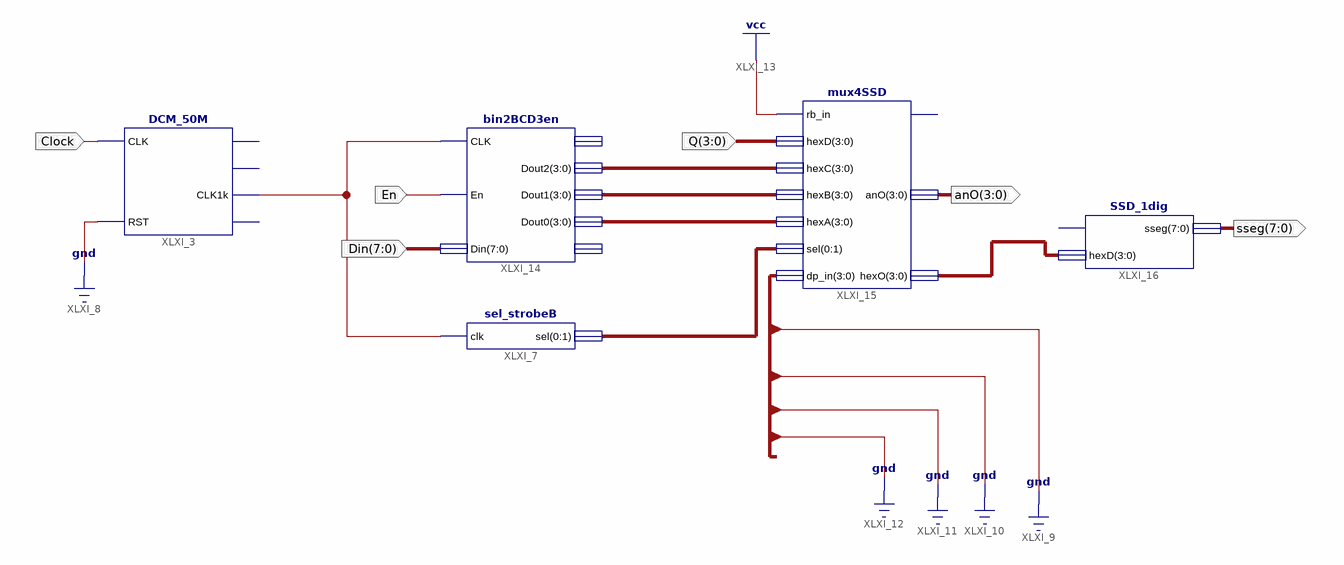
[diagram p0: schematic sheet 1]
// Xilinx ISE schematic lab9_BCDBus.sch (spartan3e) as structural Verilog: 5 symbols, 6 ports
module lab9_BCDBus (
  input  En,
  input  [7:0] Din,
  input  Clock,
  input  [3:0] Q,
  output [7:0] sseg,
  output [3:0] anO
);

  wire XLXN_31;
  wire [1:0] XLXN_15;
  wire [3:0] XLXN_6, XLXN_7, XLXN_8, XLXN_13;

  SSD_1dig XLXI_16 (.hexD(XLXN_13), .sseg(sseg));  // open: dp_in
  DCM_50M XLXI_3 (.CLK(Clock), .RST(1'b0), .CLK1k(XLXN_31));  // open: CLK1M, CLK10k, CLK1
  sel_strobeB XLXI_7 (.clk(XLXN_31), .sel({XLXN_15[0], XLXN_15[1]}));
  bin2BCD3en XLXI_14 (
    .CLK(XLXN_31), .En(En), .Din(Din), .Dout2(XLXN_8), .Dout1(XLXN_7), .Dout0(XLXN_6));  // open: Dout3, RBout
  mux4SSD XLXI_15 (
    .rb_in(1'b1), .hexD(Q), .hexC(XLXN_8), .hexB(XLXN_7), .hexA(XLXN_6), .sel({XLXN_15[0], XLXN_15[1]}),
    .dp_in(4'b0000), .anO(anO), .hexO(XLXN_13));  // open: dpO
endmodule
